# EAGLE design esp-breadboard (EAGLE 7.3.0)
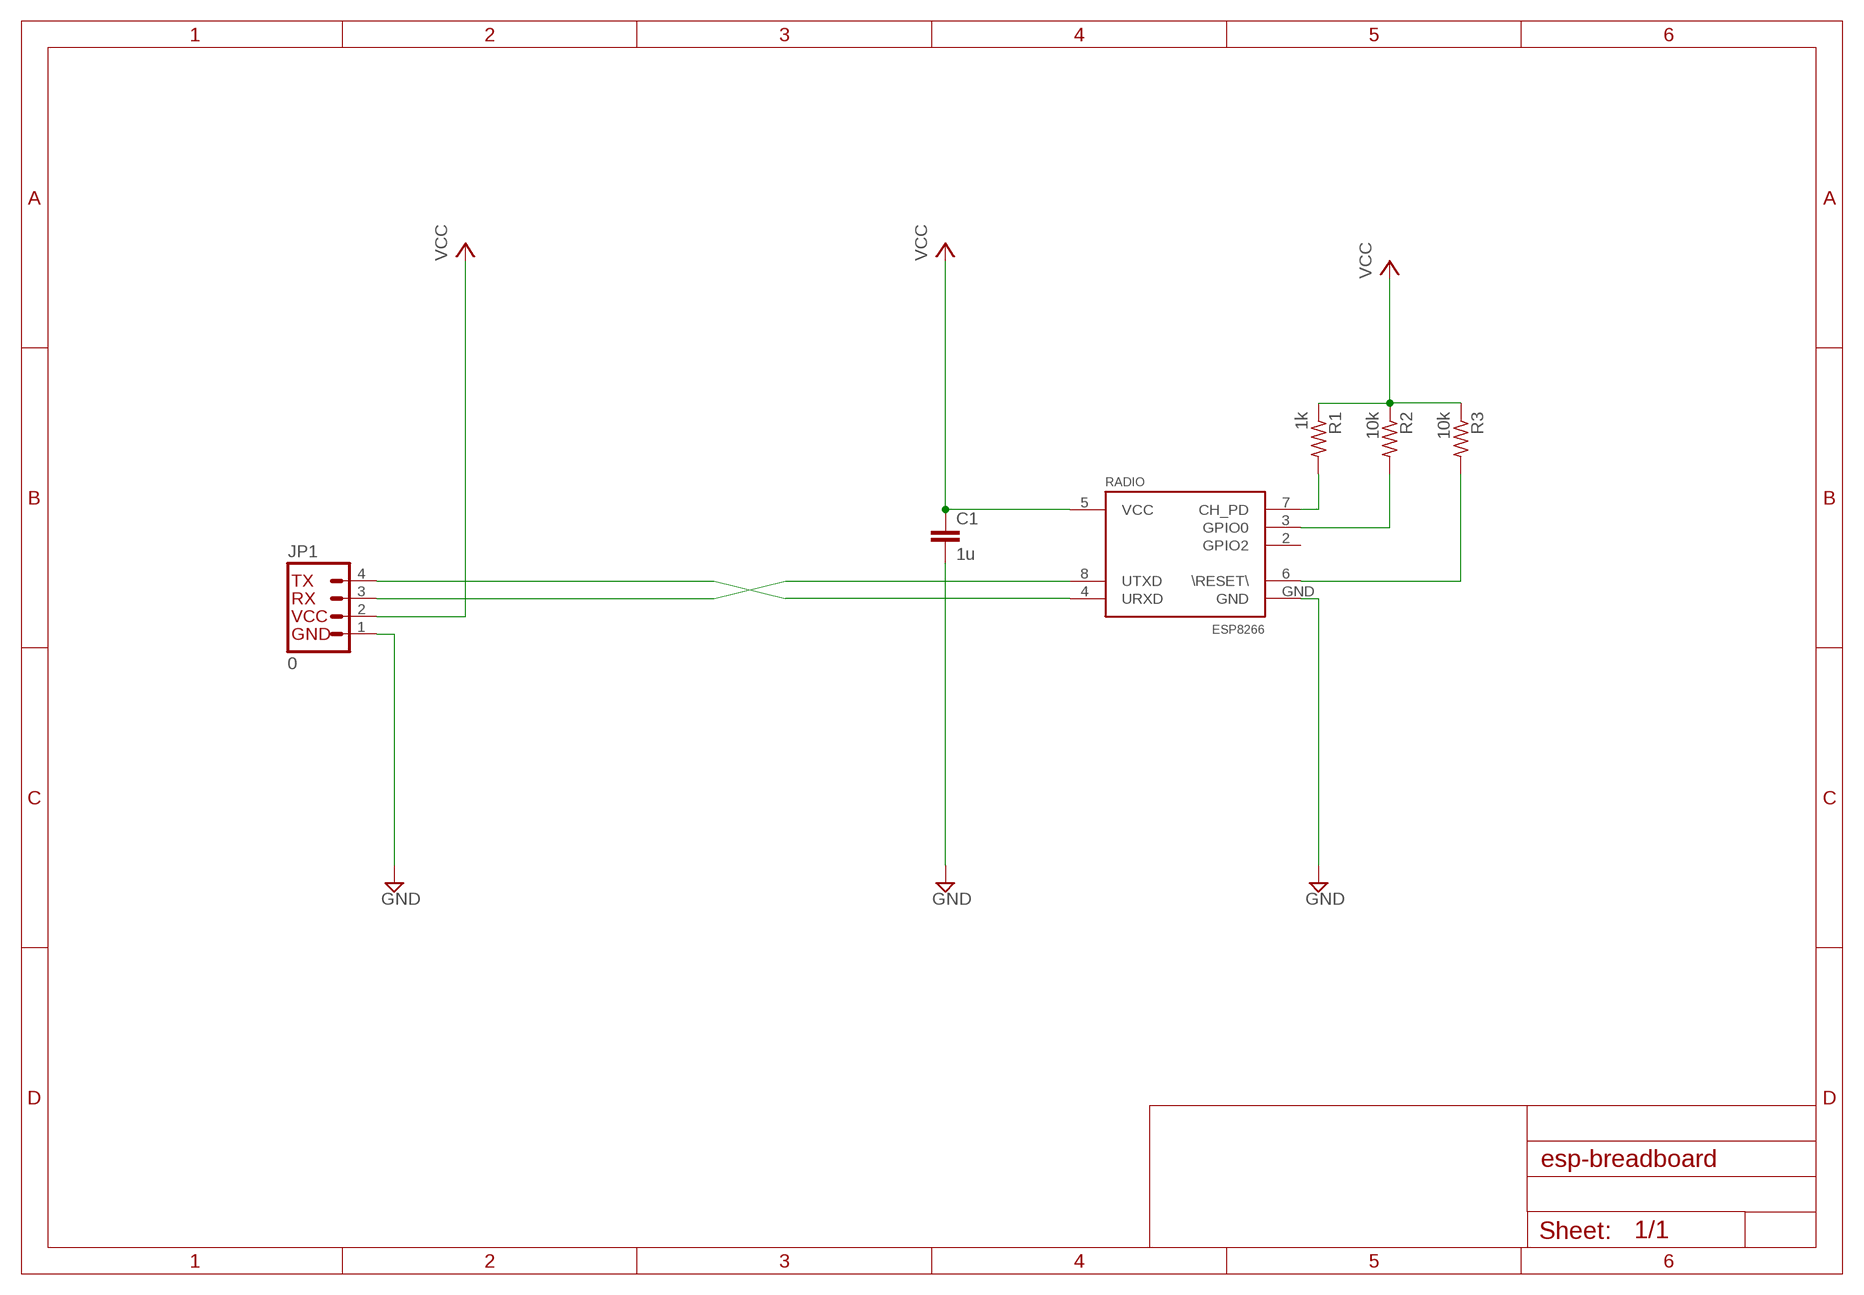
[diagram p0: schematic, sheet 1]

## Parts
C1  1u  C-EUC0805  [C0805]
JP1  0  I2C_STANDARD_NO_SILK  [1X04_NO_SILK]
R1  1k  R-US_R0805  [R0805]
R2  10k  R-US_R0805  [R0805]
R3  10k  R-US_R0805  [R0805]
RADIO  ESP8266  [ESP8266-01]

## Nets
ESPRX: JP1.4 RADIO.4(URXD)
ESPTX: JP1.3 RADIO.8(UTXD)
GND: C1.2 JP1.1 RADIO.GND
N$1: R2.2 RADIO.3(GPIO0)
N$2: R1.2 RADIO.7(CH_PD)
N$3: R3.2 RADIO.6(\RESET\)
VCC: C1.1 JP1.2 R1.1 R2.1 R3.1 RADIO.5(VCC)
Unconnected: RADIO.2(GPIO2)

## Library data of the parts
C1 = rcl:C-EU: CAPACITOR, European symbol
JP1 = esp:I2C_STANDARD: SparkFun has standardized on a pinout for all I2C based sensor breakouts. This pinout allows I2C boards to be plugged directly into the headers on Arduino Uno compatible boards, and to be daisy chained easily.
R1-R3 = rcl:R-US_: RESISTOR, American symbol
RADIO = esp:ESP8266: ESP8266 The ESP8266 WiFi Module is a self contained SOC with integrated TCP/IP protocol stack that can give any microcontroller access to your WiFi network.

## Board
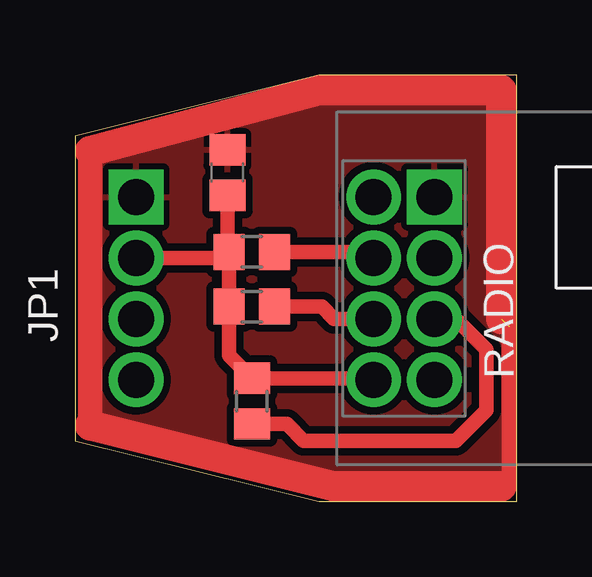
[diagram p1: board, top side]
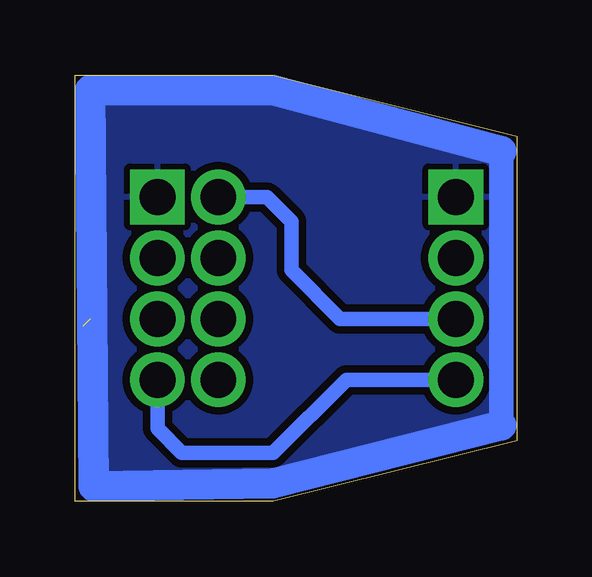
[diagram p2: board, bottom side, seen from below]

Size 18.41 x 17.78 mm. Coordinates in mm from the lower left corner, seen from the top.
Outline: 0,2.54 10.16,0 18.41,0 18.41,17.78 10.16,17.78 0,15.24 0,2.54
Copper layers (1*16): Top 0.0178mm / dielectric 59mil / Bottom 0.0178mm
Design rules "epl-lpkf": minimum track width 8mil, minimum drill 0.35mm, track to track 8mil, track to pad 8mil, pad to pad 8mil, via to via 8mil, smd to smd 8mil, copper to edge 15mil, drill to drill 15mil, minimum pad ring 8mil, minimum via ring 8mil, stop-mask expansion 3mil, vias tented up to drill 0mil, thermal gap 10mil

### Footprints (pad centres in the part's own frame; a part is rotated, then mirrored left to right if it is on the bottom)
C0805 = smd 1.3 x 1.5: 1 -0.95,0; 2 0.95,0
1X04_NO_SILK = drill 1.499 pad 2.286 square: 1 0,0 | drill 1.499 pad 2.286: 2 2.54,0; 3 5.08,0; 4 7.62,0
R0805 = smd 1.3 x 1.5: 1 -0.95,0; 2 0.95,0
ESP8266-01 = drill 1.499 pad 2.286: 2 1.27,1.27; 3 1.27,-1.27; 4 1.27,-3.81; 5 -1.27,-3.81; 6 -1.27,-1.27; 7 -1.27,1.27; 8 -1.27,3.81 | drill 1.499 pad 2.286 square: GND 1.27,3.81

### Placement (x,y rotation side)
C1  6.35,13.72 90 top
JP1  2.54,12.7 270 top
R1  7.37,10.41 0 top
R2  7.37,4.19 270 top
R3  7.37,8.13 0 top
RADIO  13.72,8.89 0 top

### Tracks (layer width: path | path; a pad name or v marks a point on that pad's centre or on a via)
ESPRX
  Bottom 0.61: JP1.4 7.11,5.08 10.16,2.03 13.97,2.03 14.99,3.05 RADIO.4
ESPTX
  Bottom 0.61: JP1.3 7.37,7.62 9.4,9.65 9.4,11.68 10.41,12.7 RADIO.8
GND  (1 unrouted)
  Top 0.635: 18.1,0.95 18.1,7.3
  Top 1.016: 0.64,3.18 0.64,14.61
  Top 1.27: 17.78,0.64 10.79,0.64 0.64,3.18 | 0.64,14.61 10.16,17.14 17.78,17.14 17.78,7.62
  Bottom 1.016: 0.64,3.18 0.64,14.61
  Bottom 1.27: 0.64,14.61 10.16,17.14 17.78,17.14 17.65,0.64 10.16,0.76 0.64,3.18
  pour Top (isolate 0.305): 0,2.54 0,15.24 10.16,17.78 18.41,17.78 18.41,0 10.16,0
  pour Bottom (isolate 0.305): 0,2.54 0,15.24 9.65,17.78 18.29,17.78 18.29,0 10.16,0
N$1
  Top 0.61: R2.2 8.82,3.24 9.53,2.54 15.88,2.54 17.14,3.81 17.14,6.35 15.88,7.62 RADIO.3
N$2
  Top 0.61: R1.2 12.19,10.41 RADIO.7
N$3
  Top 0.61: R3.2 10.29,8.13 10.79,7.62 RADIO.6
VCC
  Top 0.61: R1.1 R3.1 6.42,6.09 R2.1 12.38,5.14 RADIO.5 | C1.1 6.35,10.48 R1.1 | JP1.2 6.16,10.16 R1.1